# Altium schematic sheet FPGA.SchDoc
size A4; PageSetup: Record=PageOptions|CenterHorizontal=True|CenterVertical=True|PrintScale=0.94|XCorrection=1.00|YCorrection=1.00|PrintKind=1|BorderSize=5000000|LeftOffset=0|BottomOffset=0|Orientation=2|PaperLength=1000|PaperWidth=1000|Scale=100|PaperSource=15|PrintQuality=1200|MediaType=1|DitherType=10|PaperKind=Letter|PrintScaleMode=1
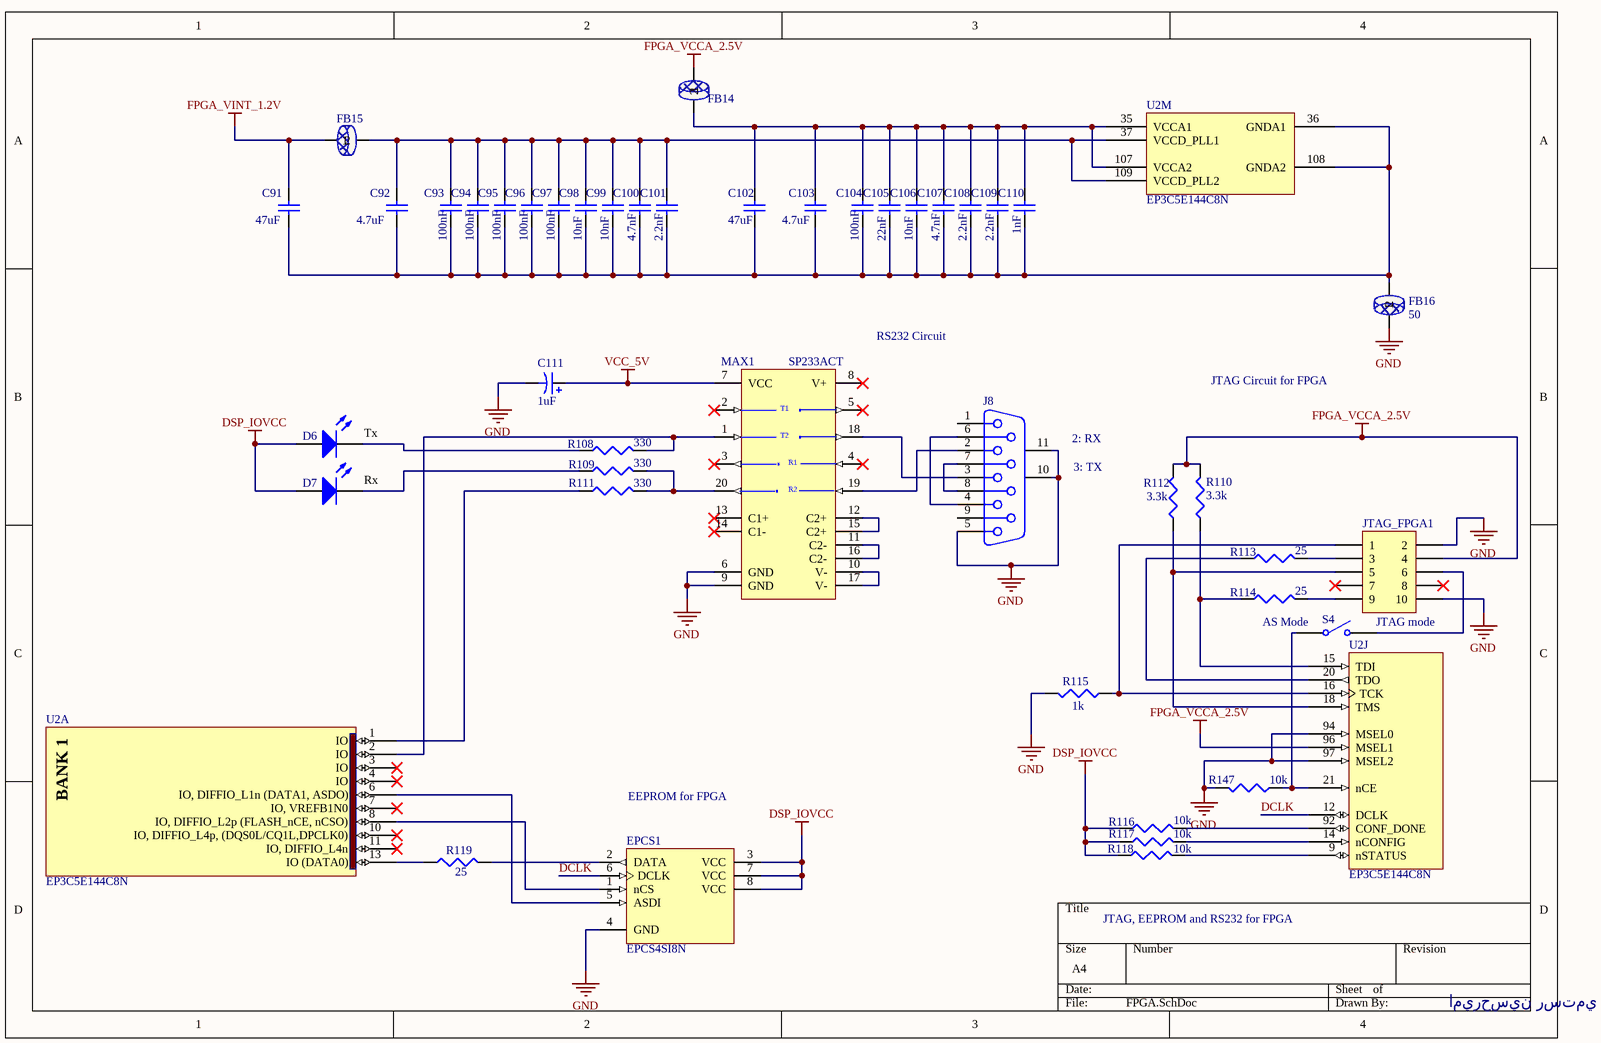
[diagram p0: FPGA.SchDoc]

## Parts
C91  value 47uF  [C1206]  (hidden comment: 470uF)
C92  4.7uF  [1608[0603]]
C93  100nF  [1608[0603]]
C94  100nF  [1608[0603]]
C95  100nF  [1608[0603]]
C96  100nF  [1608[0603]]
C97  100nF  [1608[0603]]
C98  10nF  [1608[0603]]
C99  10nF  [1608[0603]]
C100  4.7nF  [1608[0603]]
C101  2.2nF  [1608[0603]]
C102  47uF  [C1206]
C103  4.7uF  [1608[0603]]
C104  100nF  [1608[0603]]
C105  22nF  [1608[0603]]
C106  10nF  [1608[0603]]
C107  4.7nF  [1608[0603]]
C108  2.2nF  [1608[0603]]
C109  2.2nF  [1608[0603]]
C110  1nF  [1608[0603]]
C111  1uF  [C1206]
D6  Yellow  [1.6X0.8X0.4]  (value not drawn)
D7  Yellow  [1.6X0.8X0.4]  (value not drawn)
EPCS1  EPCS4SI8N  [SOIC8_M]
FB14  Ferrite Bead  [3216[1206]]  (value not drawn)
FB15  50  [3216[1206]]  (value not drawn)
FB16  50  [3216[1206]]
J8  D Connector 9  [DSUB1.385-2H9]  (value not drawn)
JTAG_FPGA1  Header 5X2  [HDR2X5]  (value not drawn)
MAX1  SP233ACT  [WSO20_L]
R108  330  [J1-0603]
R109  330  [J1-0603]
R110  3.3k  [J1-0603]
R111  330  [J1-0603]
R112  3.3k  [J1-0603]
R113  25  [J1-0603]
R114  25  [J1-0603]
R115  1k  [J1-0603]
R116  10k  [J1-0603]
R117  10k  [J1-0603]
R118  10k  [J1-0603]
R119  25  [J1-0603]
R147  10k  [J1-0603]
S4  SW-SPST  [DIP_SW_1]  (value not drawn)
U2  EP3C5E144C8N  [EQFP144_N]  (parts A,J,M of 13)

## Nets
DSP_IOVCC: D6.1(A) D7.1(A) EPCS1.3(VCC) EPCS1.7(VCC) EPCS1.8(VCC) R116.1 R117.1 R118.1
FPGA_VCCA_2.5V: FB14.2 JTAG_FPGA1.4 R110.2 R112.2 U2.96(MSEL1)
FPGA_VINT_1.2V: C91.1 FB15.2
GND: C111.2 EPCS1.4(GND) FB16.2 J8.5 J8.10(MH1) J8.11(MH2) JTAG_FPGA1.2 JTAG_FPGA1.10 MAX1.6(GND) MAX1.9(GND) R115.2 R147.2 U2.94(MSEL0) U2.97(MSEL2)
VCC_5V: C111.1 MAX1.7(VCC)
DCLK: EPCS1.6(DCLK) U2.12(DCLK)
NetC91_2: C91.2 C92.2 C93.2 C94.2 C95.2 C96.2 C97.2 C98.2 C99.2 C100.2 C101.2 C102.2 C103.2 C104.2 C105.2 C106.2 C107.2 C108.2 C109.2 C110.2 FB16.1 U2.36(GNDA1) U2.108(GNDA2)
NetC92_1: C92.1 C93.1 C94.1 C95.1 C96.1 C97.1 C98.1 C99.1 C100.1 C101.1 FB15.1 U2.37(VCCD_PLL1) U2.109(VCCD_PLL2)
NetC102_1: C102.1 C103.1 C104.1 C105.1 C106.1 C107.1 C108.1 C109.1 C110.1 FB14.1 U2.35(VCCA1) U2.107(VCCA2)
NetD6_2: D6.2(K) R108.1
NetD7_2: D7.2(K) R109.1
NetEPCS1_1: EPCS1.1(nCS) U2.8(IO,_DIFFIO_L2p_(FLASH_nCE,_nCSO))
NetEPCS1_2: EPCS1.2(DATA) R119.2
NetEPCS1_5: EPCS1.5(ASDI) U2.6(IO,_DIFFIO_L1n_(DATA1,_ASDO))
NetJ8_2: J8.2 MAX1.19(R2IN)
NetJ8_3: J8.3 MAX1.18(T2OUT)
NetJ8_4: J8.4 J8.6
NetJ8_7: J8.7 J8.8
NetJTAG_FPGA1_1: JTAG_FPGA1.1 R115.1 U2.16(TCK)
NetJTAG_FPGA1_3: JTAG_FPGA1.3 R113.2
NetJTAG_FPGA1_5: JTAG_FPGA1.5 R112.1 U2.18(TMS)
NetJTAG_FPGA1_6: JTAG_FPGA1.6 S4.2(NO)
NetJTAG_FPGA1_9: JTAG_FPGA1.9 R114.2
NetMAX1_1: MAX1.1(T2IN) R108.2 U2.2(IO)
NetMAX1_10: MAX1.10(V-) MAX1.17(V-)
NetMAX1_11: MAX1.11(C2-) MAX1.16(C2-)
NetMAX1_12: MAX1.12(C2+) MAX1.15(C2+)
NetMAX1_20: MAX1.20(R2OUT) R109.2 R111.2
NetR110_1: R110.1 R114.1 U2.15(TDI)
NetR111_1: R111.1 U2.1(IO)
NetR113_1: R113.1 U2.20(TDO)
NetR116_2: R116.2 U2.92(CONF_DONE)
NetR117_2: R117.2 U2.14(nCONFIG)
NetR118_2: R118.2 U2.9(nSTATUS)
NetR119_1: R119.1 U2.13(IO_(DATA0))
NetR147_1: R147.1 S4.1(COMMON) U2.21(nCE)

Not connected (* = marked no-connect by the designer): J8 1 9; JTAG_FPGA1 7* 8*; MAX1 2(T1IN)* 3(R1OUT)* 4(R1IN)* 5(T1OUT)* 8(V+)* 13(C1+)* 14(C1-)*; U2 3(IO)* 4(IO)* 7(IO,_VREFB1N0)* 10(IO,_DIFFIO_L4p,_(DQS0L/CQ1L,DPCLK0))* 11(IO,_DIFFIO_L4n)*

## Notes on the sheet
- RS232 Circuit
- JTAG Circuit for FPGA
- (near D6) Tx
- (near J8) 2: RX
- Rx
- 3: TX
- AS Mode
- JTAG mode
- EEPROM for FPGA
- JTAG, EEPROM and RS232 for FPGA
- اميرحسين رستمي
- (in symbol EP3C5E144C8N, part A) BANK 1
- (in symbol MAX233AEWP) T1; T2; R1; R2

## Library data of the parts
C91-C110 = Cap Semi: Capacitor; Published: 8-Jun-2000; LatestRevisionDate: 17-Jul-2002; LatestRevisionNote: Re-released for DXP Platform.; PackageReference: C1206; Publisher: Altium Limited
  C92 C103: Value: 4.7uF
  C93-C97 C104: Value: 100nF
  C98 C99 C106: Value: 10nF
  C100 C107: Value: 4.7nF
  C101 C108 C109: Value: 2.2nF
  C102: Value: 47uF
  C105: Value: 22nF
  C110: Value: 1nF
C111 = Cap Pol3: Polarized Capacitor; Published: 8-Jun-2000; LatestRevisionDate: 17-Jul-2002; LatestRevisionNote: Re-released for DXP Platform.; PackageReference: C0805; Publisher: Altium Limited; Value: 1uF
D6 D7 = LED3: LED; Published: 8-Jun-2000; LatestRevisionDate: 17-Dec-2003; LatestRevisionNote: PCB Footprint replaced.; DatasheetDocument: 16-Apr-2002; PackageDocument: 16-Apr-2002; PackageReference: 3.5X2.8X1.9; Publisher: Altium Limited
EPCS1 = EPCS4SI8N: EPCS4 Series, In-system programmable 3.3V serial configuration device, 8-Pin SOIC, 4-Megabit, Industrial Grade, Pb-Free; Configures: Cyclone II, Stratix II, & Cyclone Devices; Published: 4-Mar-2005; LatestRevisionDate: 13-Apr-2006; LatestRevisionNote: IPC-7351 Footprint Added.; DatasheetVersion: ver2.0, Oct-2003; PackageVersion: ver13.0, May-2005; PackageReference: SOIC8; Publisher: Altium Limited; PackageDescription: 8-Pin Small Outline Integrated Circuit Package (SOIC8); Code_JEDEC: MS-012-AA; Code_IPC: SOIC127P600-8; ComponentLink1Description: Manufacturer Link; ComponentLink1URL: http://www.altera.com/products/devices/config/cfg-index.html; ComponentLink2Description: Configuration Handbook; ComponentLink2URL: http://www.altera.com/literature/hb/cfg/config_handbook.pdf; ComponentLink3Description: Pinout Specification; ComponentLink3URL: http://www.altera.com/literature/hb/cfg/cyc_c51014.pdf; ComponentLink4Description: Packaging Specification; ComponentLink4URL: http://www.altera.com/literature/ds/dspkg.pdf
FB15 FB16 = Ferrite Bead
J8 = D Connector 9: Receptacle Assembly, 9 Position, Right Angle; PackageDocument: O; Positions: 9; Published: 15-Jun-2001; LatestRevisionDate: 17-Jul-2002; LatestRevisionNote: Re-released for DXP Platform.; DatasheetDocument: 1-Sep-1999; PackageReference: 788750; Publisher: Altium Limited; Orientation: Right Angle; Gender: Receptacle
JTAG_FPGA1 = Header 5X2: Header, 5-Pin, Dual row; LatestRevisionDate: 17-Jul-2002; LatestRevisionNote: Re-released for DXP Platform.; Publisher: Altium Limited
MAX1 = MAX233AEWP: +5V-Powered, Multichannel RS-232 Driver/Receiver; Published: 16-Jan-2001; LatestRevisionDate: 13-Apr-2006; LatestRevisionNote: IPC-7351 Footprint Added.; DatasheetVersion: Nov-1997; PackageReference: WSO20; Publisher: Altium Limited; PackageDescription: 20-Pin Small Outline Integrated Circuit 1.27 mm Pitch; Code_JEDEC: MS-013-AC; Code_IPC: SOIC127P1030-20; ComponentLink1Description: Manufacturer Link; ComponentLink1URL: http://www.maxim-ic.com/; ComponentLink2Description: Datasheet; ComponentLink2URL: http://pdfserv.maxim-ic.com/en/ds/MAX220-MAX249.pdf
R108-R119 R147 = Res3: Resistor; Published: 8-Jun-2000; LatestRevisionDate: 04-Mar-2005; LatestRevisionNote: PCB Footprint replaced.; PackageReference: J1-0603; Publisher: Altium Limited
  R108 R109 R111: Value: 330
  R110 R112: Value: 3.3k
  R113 R114 R119: Value: 25
  R115: Value: 1k
  R116-R118 R147: Value: 10k
S4 = SW-SPST: Single-Pole, Single-Throw Switch; Published: 24-Mar-1999; LatestRevisionDate: 17-Jul-2002; LatestRevisionNote: Re-released for DXP Platform.; PackageReference: SPST-2; Publisher: Altium Limited
U2 = EP3C5E144C8N: Cyclone III Family FPGA, 94 I/O Pins, 4 PLLs, 144-Pin EQFP, Speed Grade 8, Commercial Grade, Pb-Free; Note: Exposed pad at the bottom of this package must be connected to PCB GND.; Published: 14-Mar-2008; LatestRevisionDate: 27-Jun-2008; LatestRevisionNote: Sch pin for exposed pad added.; DatasheetVersion: ver2.0, May-2008; PackageVersion: ver15.1, May-2008; PackageReference: EQFP144; Publisher: Altium Limited; PackageDescription: 144-Pin Plastic Enhanced Quad Flat Pack (EQFP144) - Wire Bond; Code_JEDEC: MS-026-BFB; ComponentLink1Description: Manufacturer Link; ComponentLink1URL: http://www.altera.com/; ComponentLink2Description: Handbook (7.86MB); ComponentLink2URL: http://www.altera.com/literature/hb/cyc3/cyclone3_handbook.pdf; ComponentLink3Description: Packaging Specification; ComponentLink3URL: http://www.altera.com/literature/ds/dspkg.pdf